# Altium schematic sheet 06_LMS2_Misc.SchDoc: LMS7002M misc (LMS2)
size A3; Organization: Lime Microsystems; Address1: Surrey Tech Centre; Address2: Guildford GU2 7YG; Address3: Surrey; Address4: United Kingdom; SheetNumber: 6
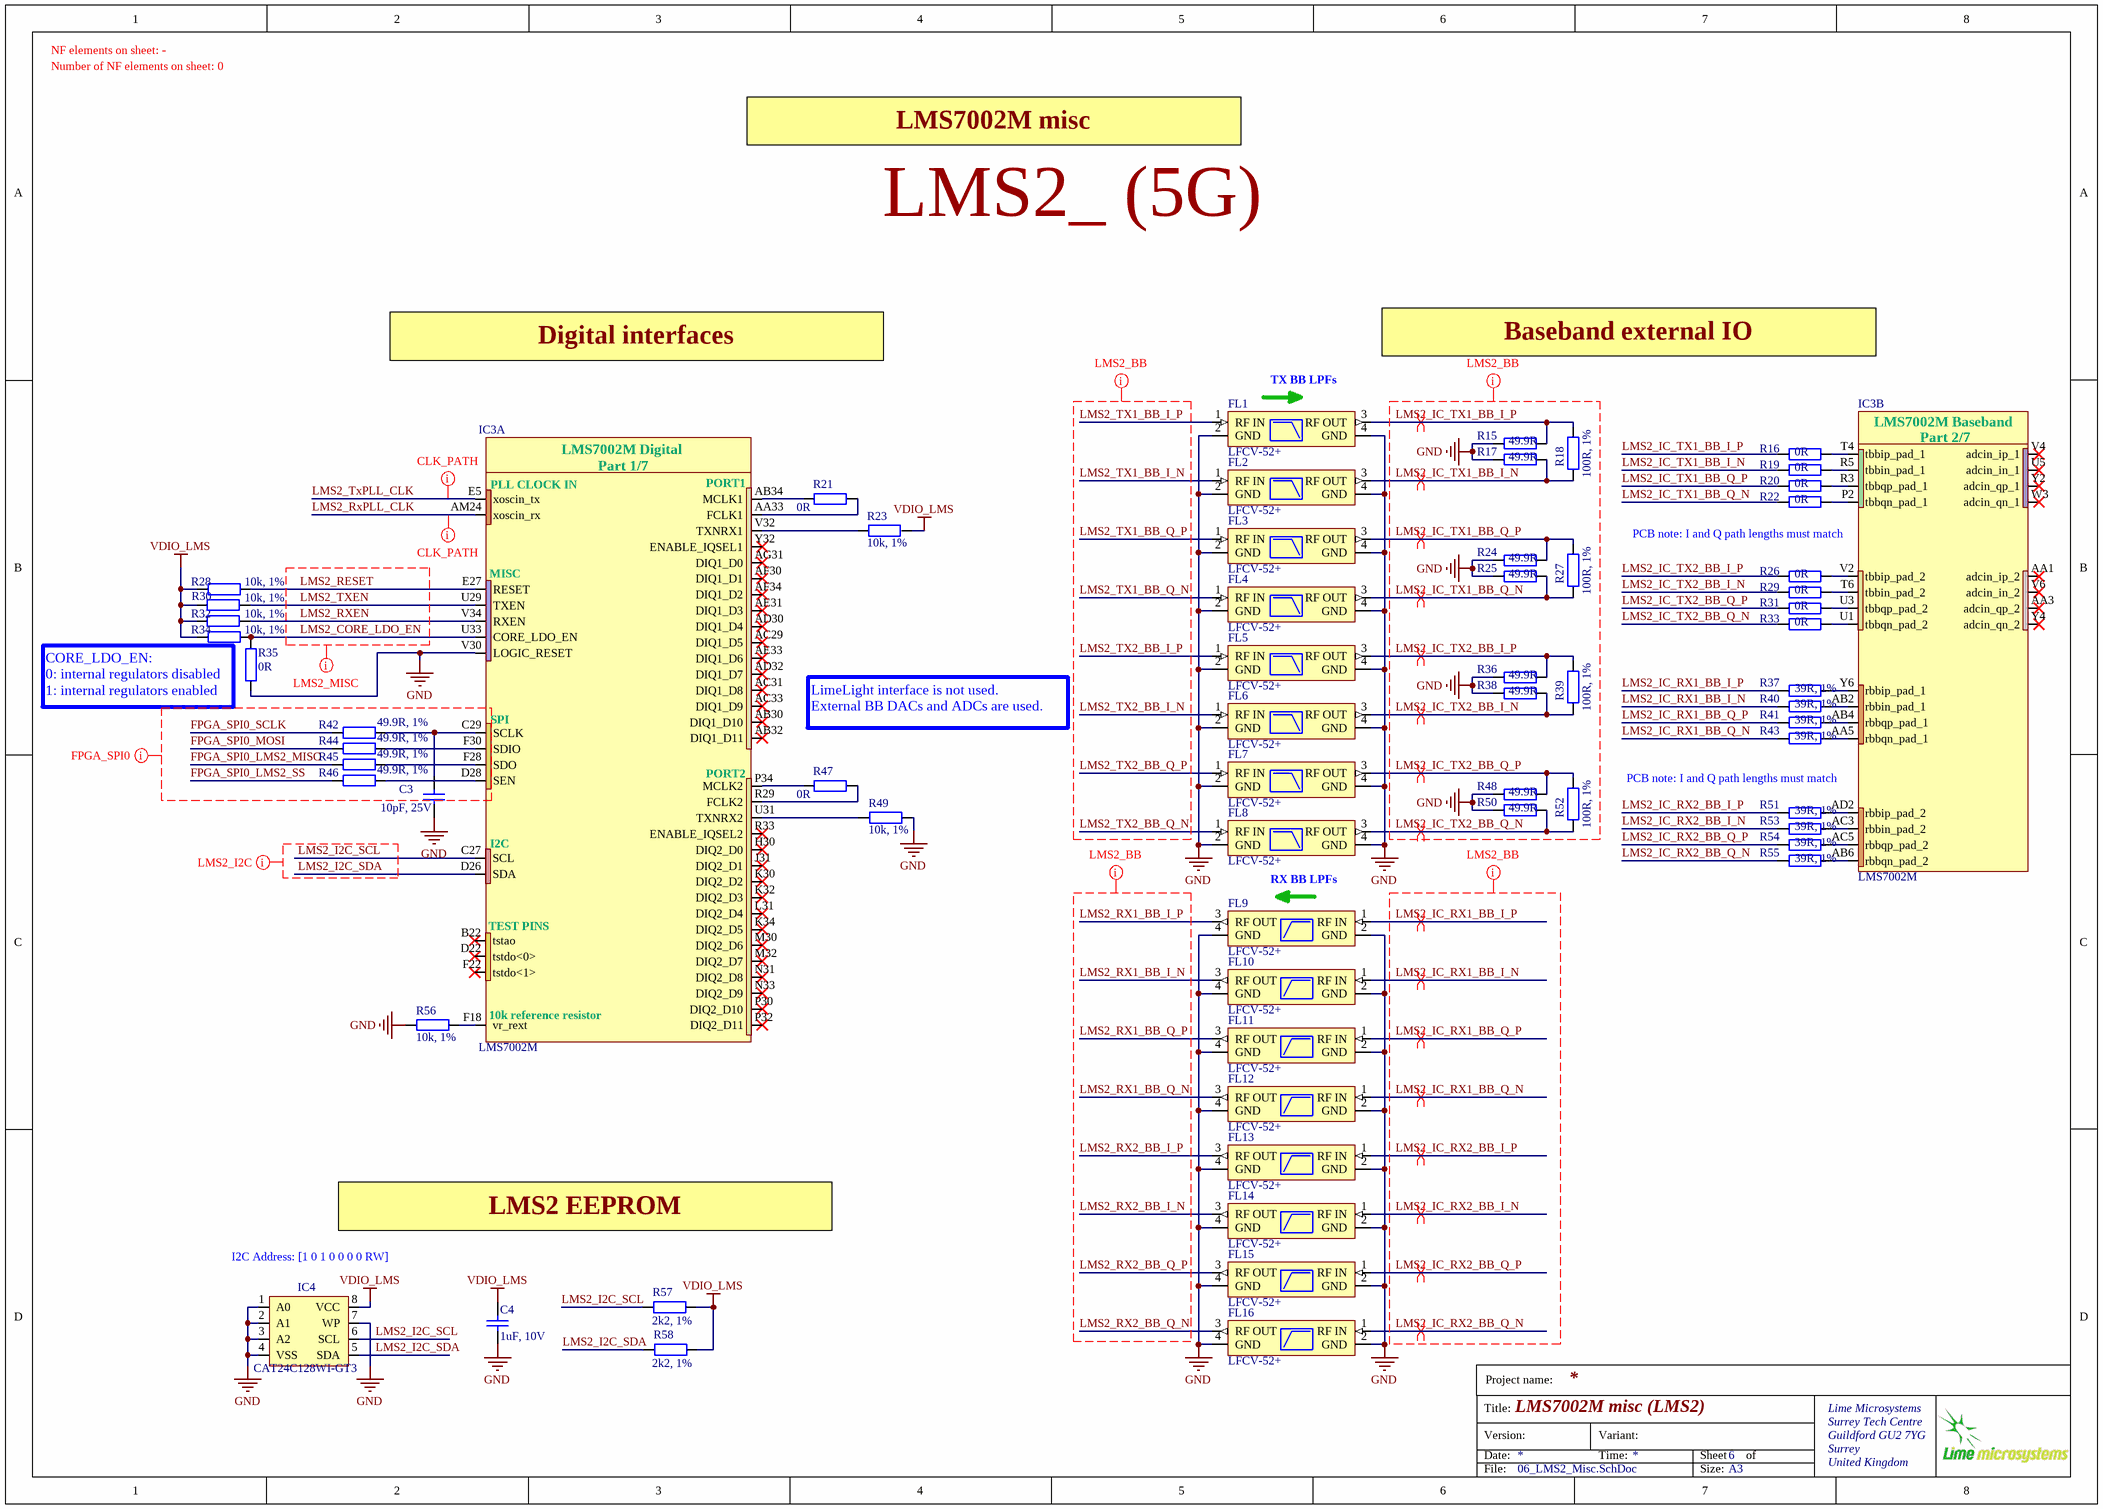
[diagram p0: 06_LMS2_Misc.SchDoc]

## Parts
C3  10pF, 25V  [CAP0402]
C4  1uF, 10V  [CAP0402]
FL1  LFCV-52+  [LFCV-52+_LPF_v2]
FL2  LFCV-52+  [LFCV-52+_LPF_v2]
FL3  LFCV-52+  [LFCV-52+_LPF_v2]
FL4  LFCV-52+  [LFCV-52+_LPF_v2]
FL5  LFCV-52+  [LFCV-52+_LPF_v2]
FL6  LFCV-52+  [LFCV-52+_LPF_v2]
FL7  LFCV-52+  [LFCV-52+_LPF_v2]
FL8  LFCV-52+  [LFCV-52+_LPF_v2]
FL9  LFCV-52+  [LFCV-52+_LPF_v2]
FL10  LFCV-52+  [LFCV-52+_LPF_v2]
FL11  LFCV-52+  [LFCV-52+_LPF_v2]
FL12  LFCV-52+  [LFCV-52+_LPF_v2]
FL13  LFCV-52+  [LFCV-52+_LPF_v2]
FL14  LFCV-52+  [LFCV-52+_LPF_v2]
FL15  LFCV-52+  [LFCV-52+_LPF_v2]
FL16  LFCV-52+  [LFCV-52+_LPF_v2]
IC3  LMS7002M  [LMS7002M_v5]  (parts A,B of 7)
IC4  CAT24C128WI-GT3  [SOIC127P600-8DL_v2]
R15  49.9R  [RES0402]
R16  0R  [RES0402]
R17  49.9R  [RES0402]
R18  100R, 1%  [RES0402]
R19  0R  [RES0402]
R20  0R  [RES0402]
R21  0R  [RES0402]
R22  0R  [RES0402]
R23  10k, 1%  [RES0402]
R24  49.9R  [RES0402]
R25  49.9R  [RES0402]
R26  0R  [RES0402]
R27  100R, 1%  [RES0402]
R28  10k, 1%  [RES0402]
R29  0R  [RES0402]
R30  10k, 1%  [RES0402]
R31  0R  [RES0402]
R32  10k, 1%  [RES0402]
R33  0R  [RES0402]
R34  10k, 1%  [RES0402]
R35  0R  [RES0402]
R36  49.9R  [RES0402]
R37  39R, 1%  [RES0402]
R38  49.9R  [RES0402]
R39  100R, 1%  [RES0402]
R40  39R, 1%  [RES0402]
R41  39R, 1%  [RES0402]
R42  49.9R, 1%  [RES0402]
R43  39R, 1%  [RES0402]
R44  49.9R, 1%  [RES0402]
R45  49.9R, 1%  [RES0402]
R46  49.9R, 1%  [RES0402]
R47  0R  [RES0402]
R48  49.9R  [RES0402]
R49  10k, 1%  [RES0402]
R50  49.9R  [RES0402]
R51  39R, 1%  [RES0402]
R52  100R, 1%  [RES0402]
R53  39R, 1%  [RES0402]
R54  39R, 1%  [RES0402]
R55  39R, 1%  [RES0402]
R56  10k, 1%  [RES0402]
R57  2k2, 1%  [RES0402]
R58  2k2, 1%  [RES0402]

## Nets
GND: C3.2 C4.2 FL1.2(GND) FL1.4(GND) FL2.2(GND) FL2.4(GND) FL3.2(GND) FL3.4(GND) FL4.2(GND) FL4.4(GND) FL5.2(GND) FL5.4(GND) FL6.2(GND) FL6.4(GND) FL7.2(GND) FL7.4(GND) FL8.2(GND) FL8.4(GND) FL9.2(GND) FL9.4(GND) FL10.2(GND) FL10.4(GND) FL11.2(GND) FL11.4(GND) FL12.2(GND) FL12.4(GND) FL13.2(GND) FL13.4(GND) FL14.2(GND) FL14.4(GND) FL15.2(GND) FL15.4(GND) FL16.2(GND) FL16.4(GND) IC3.V30(LOGIC_RESET) IC4.1(A0) IC4.2(A1) IC4.3(A2) IC4.4(VSS) IC4.7(WP) R15.2 R17.2 R24.2 R25.2 R35.1 R36.2 R38.2 R48.2 R49.1 R50.2 R56.2
VDIO_LMS: C4.1 IC4.8(VCC) R23.2 R28.2 R30.1 R32.1 R34.2 R57.1 R58.1
FPGA_SPI0_LMS2_MISO: R45.2
FPGA_SPI0_LMS2_SS: R46.2
FPGA_SPI0_MOSI: R44.2
FPGA_SPI0_SCLK: R42.2
LMS2_CORE_LDO_EN: IC3.U33(CORE_LDO_EN) R34.1 R35.2
LMS2_I2C_SCL: IC3.C27(SCL) IC4.6(SCL) R57.2
LMS2_I2C_SDA: IC3.D26(SDA) IC4.5(SDA) R58.2
LMS2_IC_RX1_BB_I_N: FL10.1(RF_IN) R40.2
LMS2_IC_RX1_BB_I_P: FL9.1(RF_IN) R37.2
LMS2_IC_RX1_BB_Q_N: FL12.1(RF_IN) R43.2
LMS2_IC_RX1_BB_Q_P: FL11.1(RF_IN) R41.2
LMS2_IC_RX2_BB_I_N: FL14.1(RF_IN) R53.2
LMS2_IC_RX2_BB_I_P: FL13.1(RF_IN) R51.2
LMS2_IC_RX2_BB_Q_N: FL16.1(RF_IN) R55.2
LMS2_IC_RX2_BB_Q_P: FL15.1(RF_IN) R54.2
LMS2_IC_TX1_BB_I_N: FL2.3(RF_OUT) R17.1 R18.2 R19.2
LMS2_IC_TX1_BB_I_P: FL1.3(RF_OUT) R15.1 R16.2 R18.1
LMS2_IC_TX1_BB_Q_N: FL4.3(RF_OUT) R22.2 R25.1 R27.2
LMS2_IC_TX1_BB_Q_P: FL3.3(RF_OUT) R20.2 R24.1 R27.1
LMS2_IC_TX2_BB_I_N: FL6.3(RF_OUT) R29.2 R38.1 R39.2
LMS2_IC_TX2_BB_I_P: FL5.3(RF_OUT) R26.2 R36.1 R39.1
LMS2_IC_TX2_BB_Q_N: FL8.3(RF_OUT) R33.2 R50.1 R52.2
LMS2_IC_TX2_BB_Q_P: FL7.3(RF_OUT) R31.2 R48.1 R52.1
LMS2_RESET: IC3.E27(RESET) R28.1
LMS2_RX1_BB_I_N: FL10.3(RF_OUT)
LMS2_RX1_BB_I_P: FL9.3(RF_OUT)
LMS2_RX1_BB_Q_N: FL12.3(RF_OUT)
LMS2_RX1_BB_Q_P: FL11.3(RF_OUT)
LMS2_RX2_BB_I_N: FL14.3(RF_OUT)
LMS2_RX2_BB_I_P: FL13.3(RF_OUT)
LMS2_RX2_BB_Q_N: FL16.3(RF_OUT)
LMS2_RX2_BB_Q_P: FL15.3(RF_OUT)
LMS2_RXEN: IC3.V34(RXEN) R32.2
LMS2_RxPLL_CLK: IC3.AM24(xoscin_rx)
LMS2_TX1_BB_I_N: FL2.1(RF_IN)
LMS2_TX1_BB_I_P: FL1.1(RF_IN)
LMS2_TX1_BB_Q_N: FL4.1(RF_IN)
LMS2_TX1_BB_Q_P: FL3.1(RF_IN)
LMS2_TX2_BB_I_N: FL6.1(RF_IN)
LMS2_TX2_BB_I_P: FL5.1(RF_IN)
LMS2_TX2_BB_Q_N: FL8.1(RF_IN)
LMS2_TX2_BB_Q_P: FL7.1(RF_IN)
LMS2_TXEN: IC3.U29(TXEN) R30.2
LMS2_TxPLL_CLK: IC3.E5(xoscin_tx)
NetC3_1: C3.1 IC3.C29(SCLK) R42.1
NetIC3_AA5: IC3.AA5(rbbqn_pad_1) R43.1
NetIC3_AA33: IC3.AA33(FCLK1) R21.2
NetIC3_AB2: IC3.AB2(rbbin_pad_1) R40.1
NetIC3_AB4: IC3.AB4(rbbqp_pad_1) R41.1
NetIC3_AB6: IC3.AB6(rbbqn_pad_2) R55.1
NetIC3_AB34: IC3.AB34(MCLK1) R21.1
NetIC3_AC3: IC3.AC3(rbbin_pad_2) R53.1
NetIC3_AC5: IC3.AC5(rbbqp_pad_2) R54.1
NetIC3_AD2: IC3.AD2(rbbip_pad_2) R51.1
NetIC3_D28: IC3.D28(SEN) R46.1
NetIC3_F18: IC3.F18(vr_rext) R56.1
NetIC3_F28: IC3.F28(SDO) R45.1
NetIC3_F30: IC3.F30(SDIO) R44.1
NetIC3_P2: IC3.P2(tbbqn_pad_1) R22.1
NetIC3_P34: IC3.P34(MCLK2) R47.1
NetIC3_R3: IC3.R3(tbbqp_pad_1) R20.1
NetIC3_R5: IC3.R5(tbbin_pad_1) R19.1
NetIC3_R29: IC3.R29(FCLK2) R47.2
NetIC3_T4: IC3.T4(tbbip_pad_1) R16.1
NetIC3_T6: IC3.T6(tbbin_pad_2) R29.1
NetIC3_U1: IC3.U1(tbbqn_pad_2) R33.1
NetIC3_U3: IC3.U3(tbbqp_pad_2) R31.1
NetIC3_U31: IC3.U31(TXNRX2) R49.2
NetIC3_V2: IC3.V2(tbbip_pad_2) R26.1
NetIC3_V32: IC3.V32(TXNRX1) R23.1
NetIC3_Y6: IC3.Y6(rbbip_pad_1) R37.1

Not connected (* = marked no-connect by the designer): IC3 AA1(adcin_ip_2)* AA3(adcin_qp_2)* AB30(DIQ1_D10)* AB32(DIQ1_D11)* AC29(DIQ1_D5)* AC31(DIQ1_D8)* AC33(DIQ1_D9)* AD30(DIQ1_D4)* AD32(DIQ1_D7)* AE31(DIQ1_D3)* AE33(DIQ1_D6)* AF30(DIQ1_D1)* AF34(DIQ1_D2)* AG31(DIQ1_D0)* B22(tstao)* D22(tstdo<0>)* F22(tstdo<1>)* H30(DIQ2_D0)* J31(DIQ2_D1)* K30(DIQ2_D2)* K32(DIQ2_D3)* K34(DIQ2_D5)* L31(DIQ2_D4)* M30(DIQ2_D6)* M32(DIQ2_D7)* N31(DIQ2_D8)* N33(DIQ2_D9)* P30(DIQ2_D10)* P32(DIQ2_D11)* R33(ENABLE_IQSEL2)* U5(adcin_in_1)* V4(adcin_ip_1)* V6(adcin_in_2)* W3(adcin_qn_1)* Y2(adcin_qp_1)* Y4(adcin_qn_2)* Y32(ENABLE_IQSEL1)*

## Layout directives
net class CLK_PATH: LMS2_RxPLL_CLK, LMS2_TxPLL_CLK
net class FPGA_SPI0: FPGA_SPI0_LMS2_MISO, FPGA_SPI0_LMS2_SS, FPGA_SPI0_MOSI, FPGA_SPI0_SCLK
net class LMS2_I2C: LMS2_I2C_SCL, LMS2_I2C_SDA
net class LMS2_MISC: LMS2_CORE_LDO_EN, LMS2_RESET, LMS2_RXEN, LMS2_TXEN
differential pair: LMS2_IC_RX1_BB_I_N, LMS2_IC_RX1_BB_I_P, LMS2_IC_RX1_BB_Q_N, LMS2_IC_RX1_BB_Q_P, LMS2_IC_RX2_BB_I_N, LMS2_IC_RX2_BB_I_P, LMS2_IC_RX2_BB_Q_N, LMS2_IC_RX2_BB_Q_P, LMS2_IC_TX1_BB_I_N, LMS2_IC_TX1_BB_I_P, LMS2_IC_TX1_BB_Q_N, LMS2_IC_TX1_BB_Q_P, LMS2_IC_TX2_BB_I_N, LMS2_IC_TX2_BB_I_P, LMS2_IC_TX2_BB_Q_N, LMS2_IC_TX2_BB_Q_P
net class LMS2_BB: GND, LMS2_IC_RX1_BB_I_N, LMS2_IC_RX1_BB_I_P, LMS2_IC_RX1_BB_Q_N, LMS2_IC_RX1_BB_Q_P, LMS2_IC_RX2_BB_I_N, LMS2_IC_RX2_BB_I_P, LMS2_IC_RX2_BB_Q_N, LMS2_IC_RX2_BB_Q_P, LMS2_IC_TX1_BB_I_N, LMS2_IC_TX1_BB_I_P, LMS2_IC_TX1_BB_Q_N, LMS2_IC_TX1_BB_Q_P, LMS2_IC_TX2_BB_I_N, LMS2_IC_TX2_BB_I_P, LMS2_IC_TX2_BB_Q_N, LMS2_IC_TX2_BB_Q_P, LMS2_RX1_BB_I_N, LMS2_RX1_BB_I_P, LMS2_RX1_BB_Q_N, LMS2_RX1_BB_Q_P, LMS2_RX2_BB_I_N, LMS2_RX2_BB_I_P, LMS2_RX2_BB_Q_N, LMS2_RX2_BB_Q_P, LMS2_TX1_BB_I_N, LMS2_TX1_BB_I_P, LMS2_TX1_BB_Q_N, LMS2_TX1_BB_Q_P, LMS2_TX2_BB_I_N, LMS2_TX2_BB_I_P, LMS2_TX2_BB_Q_N, LMS2_TX2_BB_Q_P

## Notes on the sheet
- NF elements on sheet: -
- Number of NF elements on sheet: 0
- LMS7002M misc
- LMS2_ (5G)
- Digital interfaces
- (near FL1) TX BB LPFs
- Baseband external IO
- (near IC3) PCB note: I and Q path lengths must match
- (near R34) CORE_LDO_EN:
  0: internal regulators disabled
  1: internal regulators enabled
- LimeLight interface is not used.
  External BB DACs and ADCs are used.
- RX BB LPFs
- (near IC4) I2C Address: [1 0 1 0 0 0 0 RW]
- LMS2 EEPROM
- Project name:
- Title:
- Version:
- Date:
- Variant:
- Time:
- Sheet
- of
- File:
- Size:
- A3
- (in symbol LMS7002Mr4, part A) LMS7002M Digital; Part 1/7; PLL CLOCK IN; PORT1; MISC; SPI; PORT2; I2C; TEST PINS; 10k reference resistor
- (in symbol LMS7002Mr4, part B) LMS7002M Baseband; Part 2/7

## Library data of the parts
C3 = Cap_0402: Manufacturer Part Number 1: 04023A100JAT2A; Manufacturer: AVX; Part Description: 10pF ±5% 25V C0G, NP0 Ceramic Capacitor -55°C ~ 125°C Surface Mount, MLCC 0402 (1005 Metric) 0.039" L x 0.020" W (1.00mm x 0.50mm); Capacitance Tolerance: ± 5%; Voltage Rating: 25; Ceramic Capacitor Case: 0402 [1005 Metric]; Capacitor Case Style: 0402 [1005 Metric]<!--FANDB--><div class="features-and-benefits-container"></div>; Dielectric Characteristic: C0G / NP0; SVHC: No SVHC (16-Jun-2014); Capacitance: 10; Value: 10pF, 25V; Supplier 1: Farnell; Supplier Part Number 1: 2332478RL; Product Range: -; RoHS: YES; Operating Temperature Min: -55; Operating Temperature Max: 125; Capacitance Tolerance ±: ± 5%; MSL: MSL 1 - Unlimited; Packaging: Cut Tape
C4 = Cap_0402: Manufacturer Part Number 1: C1005X5R1E105K050BC; Manufacturer: TDK; Part Description: 1µF ±10% 10V X5R Ceramic Capacitor -55°C ~ 85°C Surface Mount, MLCC 0402 (1005 Metric) 0.039" L x 0.020" W (1.00mm x 0.50mm); Voltage Rating: 10; Capacitance Tolerance: ± 10%; Product Range: TDK - C Series; Ceramic Capacitor Case: 0402 [1005 Metric]; Capacitance: 1; Dielectric Characteristic: X6; Value: 1uF, 10V; Supplier 1: Digi-Key; Supplier Part Number 1: 445-9066-1-ND; MSL: -; RoHS: YES
FL1-FL16 = LFCV-52+_LPF: Manufacturer: Mini Circuits; Part Description: Ceramic Low Pass Filter, 50Ω, DC to 52 MHz; Manufacturer Part Number 1: LFCV-52+; Supplier Part Number 1: LFCV-52+; Supplier 1: Mini Circuits
IC3 = LMS7002Mr4: Schematic symbol revision 4. Default footprint - 0.31mm pad; Manufacturer: Lime Microsystems; Part Description: IC FPRF Transceiver LMS7002M; 261 pin aQFN; Supplier 1: Lime Microsystems; Supplier Part Number 1: LMS7002M; Manufacturer Part Number 1: LMS7002M
IC4 = 24FC64F: Part Description: EEPROM Memory IC 128Kb (16K x 8) I²C 1MHz 400ns 8-SOIC; Manufacturer: ON Semiconductor; Memory Type: Non-Volatile; Memory Format: EEPROM; Memory Size: 128Kb (16K x 8); Write Cycle Time - Word, Page: 5ms; Memory Interface: I²C; Voltage - Supply: 1.8 V ~ 5.5 V; Supplier 1: Digi-Key; Supplier Part Number 1: CAT24C128WI-GT3CT-ND; Manufacturer Part Number 1: CAT24C128WI-GT3; RoHS: RoHS Compliant; Category: Integrated Circuits (ICs); Stock 1: 14804; Pricing 1: 1=0.31, 10=0.309, 100=0.2532, 500=0.24616, 1000=0.23956 (USD); Packaging: Cut Tape (CT); Part Status: Active; Technology: EEPROM; Operating Temperature: -40°C ~ 85°C (TA); Mounting Type: Surface Mount; Package / Case: 8-SOIC (0.154", 3.90mm Width); Supplier Device Package: 8-SOIC; Base Part Number: CAT24C128; ComponentLink1URL: http://www.onsemi.com/pub/Collateral/CAT24C128-D.PDF; ComponentLink1Description: http://www.onsemi.com/pub/Collateral/CAT24C128-D.PDF
R15 R17 R24 R25 R36 R38 R48 R50 = Res_0402: Manufacturer: Samsung Electro-Mechanics America, Inc.; Part Description: RES SMD 49.9 OHM 1% 1/16W 0402; Manufacturer Part Number 1: RC1005F49R9CS; Temperature Coefficient: ±100ppm/°C; Resistance (Ohms): 49.9; Tolerance: ±1%; Power (Watts): 0.063W, 1/16W; Number of Terminations: 2; Size / Dimension: 0.039" L x 0.020" W (1.00mm x 0.50mm); Supplier Device Package: 0402 (1005 Metric); RoHS: RoHS Compliant; Supplier Part Number 1: 1276-3469-6-ND; Features: -; Packaging: Digi-Reel®; Height: 0.016" (0.40mm); Category: Resistors; Composition: Thick Film; Package / Case: 0402 (1005 Metric); Supplier 1: Digi-Key; Operating Temperature: -55°C ~ 155°C; Value: 49.9R
R16 R19 R20 R22 R26 R29 R31 R33 = Res_0402: Manufacturer: Yageo; Part Description: RES SMD 0.0OHM JUMPER 1/16W 0402; Manufacturer Part Number 1: RC0402JR-070RL; Supplier 1: Digi-Key; Supplier Part Number 1: 311-0.0JRTR-ND; Composition: Thick Film; Package / Case: 0402 (1005 Metric); Category: Resistors; Value: 0R
R18 R27 R39 R52 = Res_0402: Manufacturer Part Number 1: RMCF0402FT100R; Manufacturer: Stackpole Electronics Inc.; Part Description: RES SMD 100 OHM 1% 1/16W 0402; Power (Watts): 0.063W, 1/16W; Temperature Coefficient: ±100ppm/°C; Resistance (Ohms): 100; Value: 100R, 1%; Supplier 1: Digi-Key; Supplier Part Number 1: RMCF0402FT100RDKR-ND; Packaging: Digi-Reel®; Composition: Thick Film; Number of Terminations: 2; Package / Case: 0402 (1005 Metric); RoHS: RoHS Compliant; Category: Resistors; Size / Dimension: 0.039" L x 0.020" W (1.00mm x 0.50mm); Tolerance: ±1%; Supplier Device Package: 0402; Features: -; Height: 0.016" (0.40mm); Operating Temperature: -55°C ~ 155°C
R21 R35 R47 = Res_0402: Manufacturer Part Number 1: RC0402JR-070RL; Manufacturer: Yageo; Part Description: RES SMD 0.0OHM JUMPER 1/16W 0402; Resistance (Ohms): 0.0; Tolerance: Jumper; Power (Watts): 0.063W, 1/16W; Value: 0R; Supplier 1: Digi-Key; Supplier Part Number 1: 311-0.0JRTR-ND; Category: Resistors; Temperature Coefficient: -; Features: Moisture Resistant; Supplier Device Package: 0402; Height: 0.016" (0.40mm); Package / Case: 0402 (1005 Metric); Operating Temperature: -55°C ~ 155°C; Size / Dimension: 0.039" L x 0.020" W (1.00mm x 0.50mm); Composition: Thick Film; Packaging: Tape & Reel (TR); Number of Terminations: 2; RoHS: RoHS Compliant
R23 R28 R30 R32 R34 R49 R56 = Res_0402: Manufacturer: Yageo; Manufacturer Part Number 1: RC0402FR-0710KL; Part Description: RES SMD 10K OHM 1% 1/16W 0402; Temperature Coefficient: ±100ppm/°C; Power (Watts): 0.063W, 1/16W; Value: 10k, 1%; Supplier 1: Digi-Key; Supplier Part Number 1: 311-10.0KLRTR-ND; Resistance (Ohms): 10k; Packaging: Tape & Reel (TR); RoHS: RoHS Compliant; Package / Case: 0402 (1005 Metric); Tolerance: ±1%; Operating Temperature: -55°C ~ 155°C; Size / Dimension: 0.039" L x 0.020" W (1.00mm x 0.50mm); Number of Terminations: 2; Category: Resistors; Height: 0.016" (0.40mm); Supplier Device Package: 0402; Features: Moisture Resistant; Composition: Thick Film
R37 R40 R41 R43 R51 R53-R55 = Res_0402: Manufacturer: Yageo; Manufacturer Part Number 1: RC0402FR-0739RL; Part Description: 39 Ohms ±1% 0.063W, 1/16W Chip Resistor 0402 (1005 Metric) Moisture Resistant Thick Film; Power Rating: 63mW; Voltage Rating: 50V; Temperature Coefficient: 100ppm/°C; Value: 39R, 1%; ComponentLink1URL: http://www.yageo.com.tw/exep/pages/download/literatures/PYu-R_INT-thick_7.pdf?src-supplier=Digi-Key; ComponentLink1Description: http://www.yageo.com.tw/exep/pages/download/literatures/PYu-R_INT-thick_7.pdf?src-supplier=Digi-Key; ComponentLink2URL: http://www.yageo.com/NewPortal/yageodocoutput?fileName=/pdf/R-Chip/PYu-RC_51_RoHS_P_0.pdf&src-supplier=Digi-Key; ComponentLink2Description: http://www.yageo.com/NewPortal/yageodocoutput?fileName=/pdf/R-Chip/PYu-RC_51_RoHS_P_0.pdf&src-supplier=Digi-Key; Supplier 1: Digi-Key; Supplier Part Number 1: 311-39.0LRCT-ND; Stock 1: 1060646; Pricing 1: 1=0,10000, 10=0,01600, 100=0,00660, 1000=0,00299, 2500=0,00259, 5000=0,00214 (USD); RoHS: Yes; Case/Package: 0402; Case Code (Imperial): 0402; Case Code (Metric): 1005; Weight: 2.3E-05oz; Contact Plating: Tin,Matte; Min Operating Temperature: -55°C; Max Operating Temperature: 155°C; Tolerance: 1%; Package Quantity: 1; Packaging: Tape and Reel; Features: Moisture Resistant; Resistance: 39R; Termination: SMD/SMT; Resistor Type: Thick Film; Number of Terminations: 2; Max Power Dissipation: 63mW; Working Voltage: 50V; Series: RC; Resistance Tolerance: 1%; Construction: Rectangular; Technology: THICK FILM; Length: 1mm; Width: 0.5mm; Height: 0.016inch; Depth: 0.5mm; Radiation Hardening: No; Lead Free: Lead Free; REACH SVHC: Unknown; Military Standard: Not; RoHS Compliant: Yes; ComponentLink3URL: https://datasheet.ciiva.com/11819/0900766b80c66297-11819479.pdf?src-supplier=RSComponents; ComponentLink3Description: https://datasheet.ciiva.com/11819/0900766b80c66297-11819479.pdf?src-supplier=RSComponents; ComponentLink4URL: https://datasheet.ciiva.com/2519/pyu-r-int-thick-7-2519001.pdf?src-supplier=Digi-Key; ComponentLink4Description: https://datasheet.ciiva.com/2519/pyu-r-int-thick-7-2519001.pdf?src-supplier=Digi-Key; ComponentLink5URL: https://datasheet.ciiva.com/2519/pyu-r-int-thick-7-2519002.pdf?src-supplier=Digi-Key; ComponentLink5Description: https://datasheet.ciiva.com/2519/pyu-r-int-thick-7-2519002.pdf?src-supplier=Digi-Key; ComponentLink6URL: https://datasheet.ciiva.com/2519/pyu-r-int-thick-7-2519000.pdf?src-supplier=Digi-Key; ComponentLink6Description: https://datasheet.ciiva.com/2519/pyu-r-int-thick-7-2519000.pdf?src-supplier=Digi-Key; ComponentLink7URL: https://datasheet.ciiva.com/7849/1018594-7849983.pdf?src-supplier=Element14; ComponentLink7Description: https://datasheet.ciiva.com/7849/1018594-7849983.pdf?src-supplier=Element14; ComponentLink8URL: https://datasheet.ciiva.com/7849/1018594-7849982.pdf?src-supplier=Element14; ComponentLink8Description: https://datasheet.ciiva.com/7849/1018594-7849982.pdf?src-supplier=Element14; ComponentLink9URL: https://datasheet.ciiva.com/8889/pyu-rc0402-51-rohs-l-6-8889306.pdf?src-supplier=Avnet; ComponentLink9Description: https://datasheet.ciiva.com/8889/pyu-rc0402-51-rohs-l-6-8889306.pdf?src-supplier=Avnet; ComponentLink10URL: https://datasheet.ciiva.com/16741/pyu-rc0402-51-rohs-l-6-r-16741016.pdf?src-supplier=Future+Electronics; ComponentLink10Description: https://datasheet.ciiva.com/16741/pyu-rc0402-51-rohs-l-6-r-16741016.pdf?src-supplier=Future+Electronics; ComponentLink11URL: https://datasheet.ciiva.com/15189/getdatasheetpartid-325130-15189445.pdf?src-supplier=Verical; ComponentLink11Description: https://datasheet.ciiva.com/15189/getdatasheetpartid-325130-15189445.pdf?src-supplier=Verical
R42 R44-R46 = Res_0402: Manufacturer: Samsung Electro-Mechanics America, Inc.; Manufacturer Part Number: RC1005F49R9CS; Part Description: RES SMD 49.9 OHM 1% 1/16W 0402; Temperature Coefficient: ±100ppm/°C; Resistance (Ohms): 49.9; Power (Watts): 0.063W, 1/16W; Number of Terminations: 2; Size / Dimension: 0.039" L x 0.020" W (1.00mm x 0.50mm); Supplier Device Package: 0402 (1005 Metric); RoHS: RoHS Compliant; Supplier Part Number 1: 1276-3469-6-ND; Features: -; Packaging: Digi-Reel®; Tolerance: ±1%; Height: 0.016" (0.40mm); Category: Resistors; Composition: Thick Film; Package / Case: 0402 (1005 Metric); Supplier 1: Digi-Key; Operating Temperature: -55°C ~ 155°C; Value: 49.9R, 1%; Manufacturer Part Number 1: RC1005F49R9CS
R57 R58 = Res_0402: Manufacturer: Stackpole Electronics Inc; Manufacturer Part Number 1: RMCF0402FT2K20; Part Description: RES SMD 2.2K OHM 1% 1/16W 0402; Resistance (Ohms): 2.2k; Temperature Coefficient: ±100ppm/°C; Power (Watts): 0.063W, 1/16W; Value: 2k2, 1%; Supplier 1: Digi-Key; Supplier Part Number 1: RMCF0402FT2K20CT-ND; Supplier Device Package: 0402; Package / Case: 0402 (1005 Metric); Size / Dimension: 0.039" L x 0.020" W (1.00mm x 0.50mm); Operating Temperature: -55°C ~ 155°C; Composition: Thick Film; Category: Resistors; Features: -; Height: 0.016" (0.40mm); RoHS: RoHS Compliant; Number of Terminations: 2; Packaging: Cut Tape (CT); Tolerance: ±1%